# Altium project 电解水杯V1.1_ZM_20210702.PrjPCB
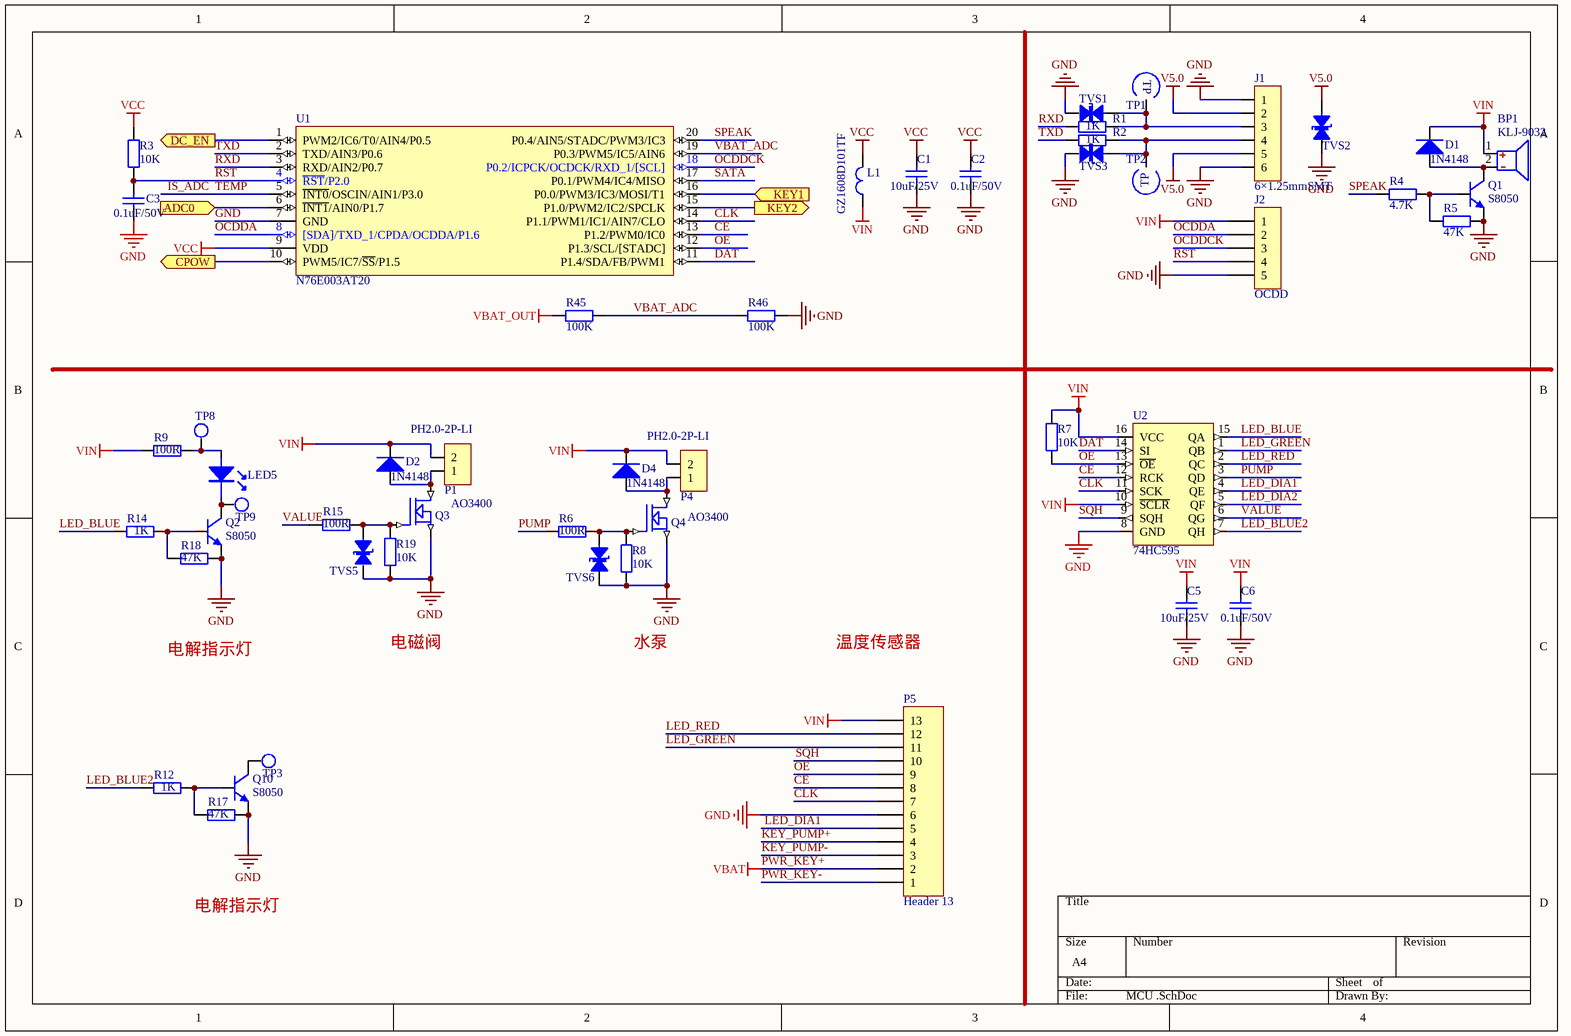
[diagram p0: MCU .SchDoc]
3 sheets, 137 parts. Net scope: global (net labels, ports and power ports of the same name join across sheets).
Board file: 水杯V1.1_ZM_20210702.PcbDoc
Sheets:
  MCU .SchDoc
  POWER.SchDoc
  Sheet2.SchDoc

## Sheet MCU .SchDoc
size A4

### Parts
BP1  KLJ-9032  [SP9025]
C1  10uF/25V  [SMD-0603C]
C2  0.1uF/50V  [SMD-0603C]
C3  0.1uF/50V  [SMD-0603C]
C5  10uF/25V  [SMD-0603C]
C6  0.1uF/50V  [SMD-0603C]
D1  1N4148  [SOD-123]
D2  1N4148  [SOD-123]
D4  1N4148  [SOD-123]
J1  6×1.25mmSMT  [6×1.25mmSMT]
J2  OCDD  [sip-5]
L1  GZ1608D101TF  [SMD-0603]
LED5  蓝光 3528  [led-3528]  (value not drawn)
P1  PH2.0-2P-LI  [PH2.0-2P-LI]
P4  PH2.0-2P-LI  [PH2.0-2P-LI]
P5  Header 13  [13×1.25mmSMT]
Q1  S8050  [SOT-23]
Q2  S8050  [SOT-23]
Q3  AO3400  [SOT-23]
Q4  AO3400  [SOT-23]
Q10  S8050  [SOT-23]
R1  1K  [SMD-0603]
R2  1K  [SMD-0603]
R3  10K  [SMD-0603]
R4  4.7K  [SMD-0603]
R5  47K  [SMD-0603]
R6  100R  [SMD-0603]
R7  10K  [SMD-0603]
R8  10K  [SMD-0603]
R9  100R  [SMD-0805]
R12  1K  [SMD-0603]
R14  1K  [SMD-0603]
R15  100R  [SMD-0603]
R17  47K  [SMD-0603]
R18  47K  [SMD-0603]
R19  10K  [SMD-0603]
R45  100K  [SMD-0603]
R46  100K  [SMD-0603]
TP1  testpoint  [TP]  (value not drawn)
TP2  testpoint  [TP]  (value not drawn)
TP3  TPS  [HOLE]  (value not drawn)
TP8  TPS  [HOLE]  (value not drawn)
TP9  TPS  [HOLE]  (value not drawn)
TVS1  ESD5Z5.0CT1G  [SOD-523]  (value not drawn)
TVS2  ESD5Z5.0CT1G  [SOD-123]  (value not drawn)
TVS3  ESD5Z5.0CT1G  [SOD-523]  (value not drawn)
TVS5  ESD5Z5.0CT1G  [SOD-523]  (value not drawn)
TVS6  ESD5Z5.0CT1G  [SOD-523]  (value not drawn)
U1  N76E003AT20  [TSSOP20]
U2  74HC595  [SSOP-16]

### Ports
ADC0 (in), CPOW (out), DC_EN (out), KEY1 (in), KEY2 (out)

### Nets
GND: C1.1 C2.1 C3.2 C5.1 C6.1 J1.1 J1.6 J2.5 P5.6 Q1.2(E) Q2.2(E) Q3.2(S) Q4.2(S) Q10.2(E) R5.2 R8.1 R17.2 R18.2 R19.1 R46.2 TVS1.1(A) TVS2.1(A) TVS3.1(A) TVS5.1(A) TVS6.1(A) U1.7(GND) U2.8(GND)
KEY_PUMP+: BP1.1(VCC) C5.2 C6.2 D1.2(K) D2.2(K) D4.2(K) J2.1 L1.1 P1.2 P4.2 P5.4 P5.13 R7.2 R9.2 U2.10(~{SCLR}) U2.16(VCC)  [also labelled VIN]
PWR_KEY+: P5.2  [also labelled VBAT]
SATA: J1.2 J1.5 TVS2.2(B) U1.17(P0.1/PWM4/IC4/MISO)  [also labelled V5.0]
VBAT_OUT: R45.1
VCC: C1.2 C2.2 L1.2 R3.1 U1.9(VDD)
CE: P5.8 U1.13(P1.2/PWM0/IC0) U2.12(RCK)
CLK: P5.7 U1.14(P1.1/PWM1/IC1/AIN7/CLO) U2.11(SCK)
DAT: U1.11(P1.4/SDA/FB/PWM1) U2.14(SI)
IS_ADC: U1.5(~{INT0}/OSCIN/AIN1/P3.0)  [also labelled TEMP]
KEY_PUMP-: P5.3
LED_BLUE: R14.1 U2.15(QA)
LED_BLUE2: R12.1 U2.7(QH)
LED_DIA1: P5.5 U2.4(QE)
LED_DIA2: U2.5(QF)
LED_GREEN: P5.11 U2.1(QB)
LED_RED: P5.12 U2.2(QC)
OCDDA: J2.2 U1.8([SDA]/TXD_1/CPDA/OCDDA/P1.6)
OCDDCK: J2.3 U1.18(P0.2/ICPCK/OCDCK/RXD_1/[SCL])
OE: P5.9 R7.1 U1.12(P1.3/SCL/[STADC]) U2.13(~{OE})
PUMP: R6.1 U2.3(QD)
PWR_KEY-: P5.1
RST: C3.1 J2.4 R3.2 U1.4(~{RST}/P2.0)
RXD: R1.2 U1.3(RXD/AIN2/P0.7)
SPEAK: R4.1 U1.20(P0.4/AIN5/STADC/PWM3/IC3)
SQH: P5.10 U2.9(SQH)
TXD: R2.2 U1.2(TXD/AIN3/P0.6)
VALUE: R15.1 U2.6(QG)
VBAT_ADC: R45.2 R46.1 U1.19(P0.3/PWM5/IC5/AIN6)
NetBP1_2: BP1.2 D1.1(A) Q1.3(C)
NetC18_2: U1.15(P1.0/PWM2/IC2/SPCLK) ; port KEY2
NetC26_1: U1.6(~{INT1}/AIN0/P1.7) ; port ADC0
NetD2_1: D2.1(A) P1.1 Q3.3(D)
NetD4_1: D4.1(A) P4.1 Q4.3(D)
NetJ1_3: J1.3 R1.1 TP1.1 TVS1.2(B)
NetJ1_4: J1.4 R2.1 TP2.1 TVS3.2(B)
NetLED5_1: LED5.1 R9.1 TP8.1
NetLED5_2: LED5.2 Q2.3(C) TP9.1
NetQ1_1: Q1.1(B) R4.2 R5.1
NetQ2_1: Q2.1(B) R14.2 R18.1
NetQ3_1: Q3.1(G) R15.2 R19.2 TVS5.2(B)
NetQ4_1: Q4.1(G) R6.2 R8.2 TVS6.2(B)
NetQ10_1: Q10.1(B) R12.2 R17.1
NetQ10_3: Q10.3(C) TP3.1
NetR16_1: U1.16(P0.0/PWM3/IC3/MOSI/T1) ; port KEY1
NetR26_1: U1.10(PWM5/IC7/~{SS}/P1.5) ; port CPOW
NetR33_1: U1.1(PWM2/IC6/T0/AIN4/P0.5) ; port DC_EN

### Notes on the sheet
- 电解指示灯
- 电磁阀
- 水泵
- 温度传感器
- (in symbol TP-1) TP

### Library data of the parts
BP1 = SPEAKER: 无源蜂鸣器 3.3V 频率2731
C1-C3 C5 C6 = CAP4: 贴片电容 10%
D1 D2 D4 = DIODE2: 小封装二极管
J1 = SIP-6: USB 3.1 Type-C 2.0短体母座 6P贴片式
J2 = SIP-5: 下载口(NC)
L1 = CIZHU1: 贴片磁珠100R 100M
LED5 = LED0: LED 3528 蓝
P1 P4 = SIP-2: 间距2.0mm 立贴 2Pin
P5 = Header 13: Header, 13-Pin; LatestRevisionDate: 17-Jul-2002; LatestRevisionNote: Re-released for DXP Platform.; Publisher: Altium Limited
Q1 Q2 Q10 = NPN-1: NPN
Q3 Q4 = MOSFET N
R1-R9 R12 R14 R15 R17-R19 R45 R46 = RES0: 贴片电阻 5%
TP1 TP2 = TP-1: 测试点
TVS1-TVS3 TVS5 TVS6 = TVS-1: ESD二极管
U1 = N76E003AT20: 新唐MCU
U2 = 74HC595: 逻辑IC

## Sheet POWER.SchDoc
size A3
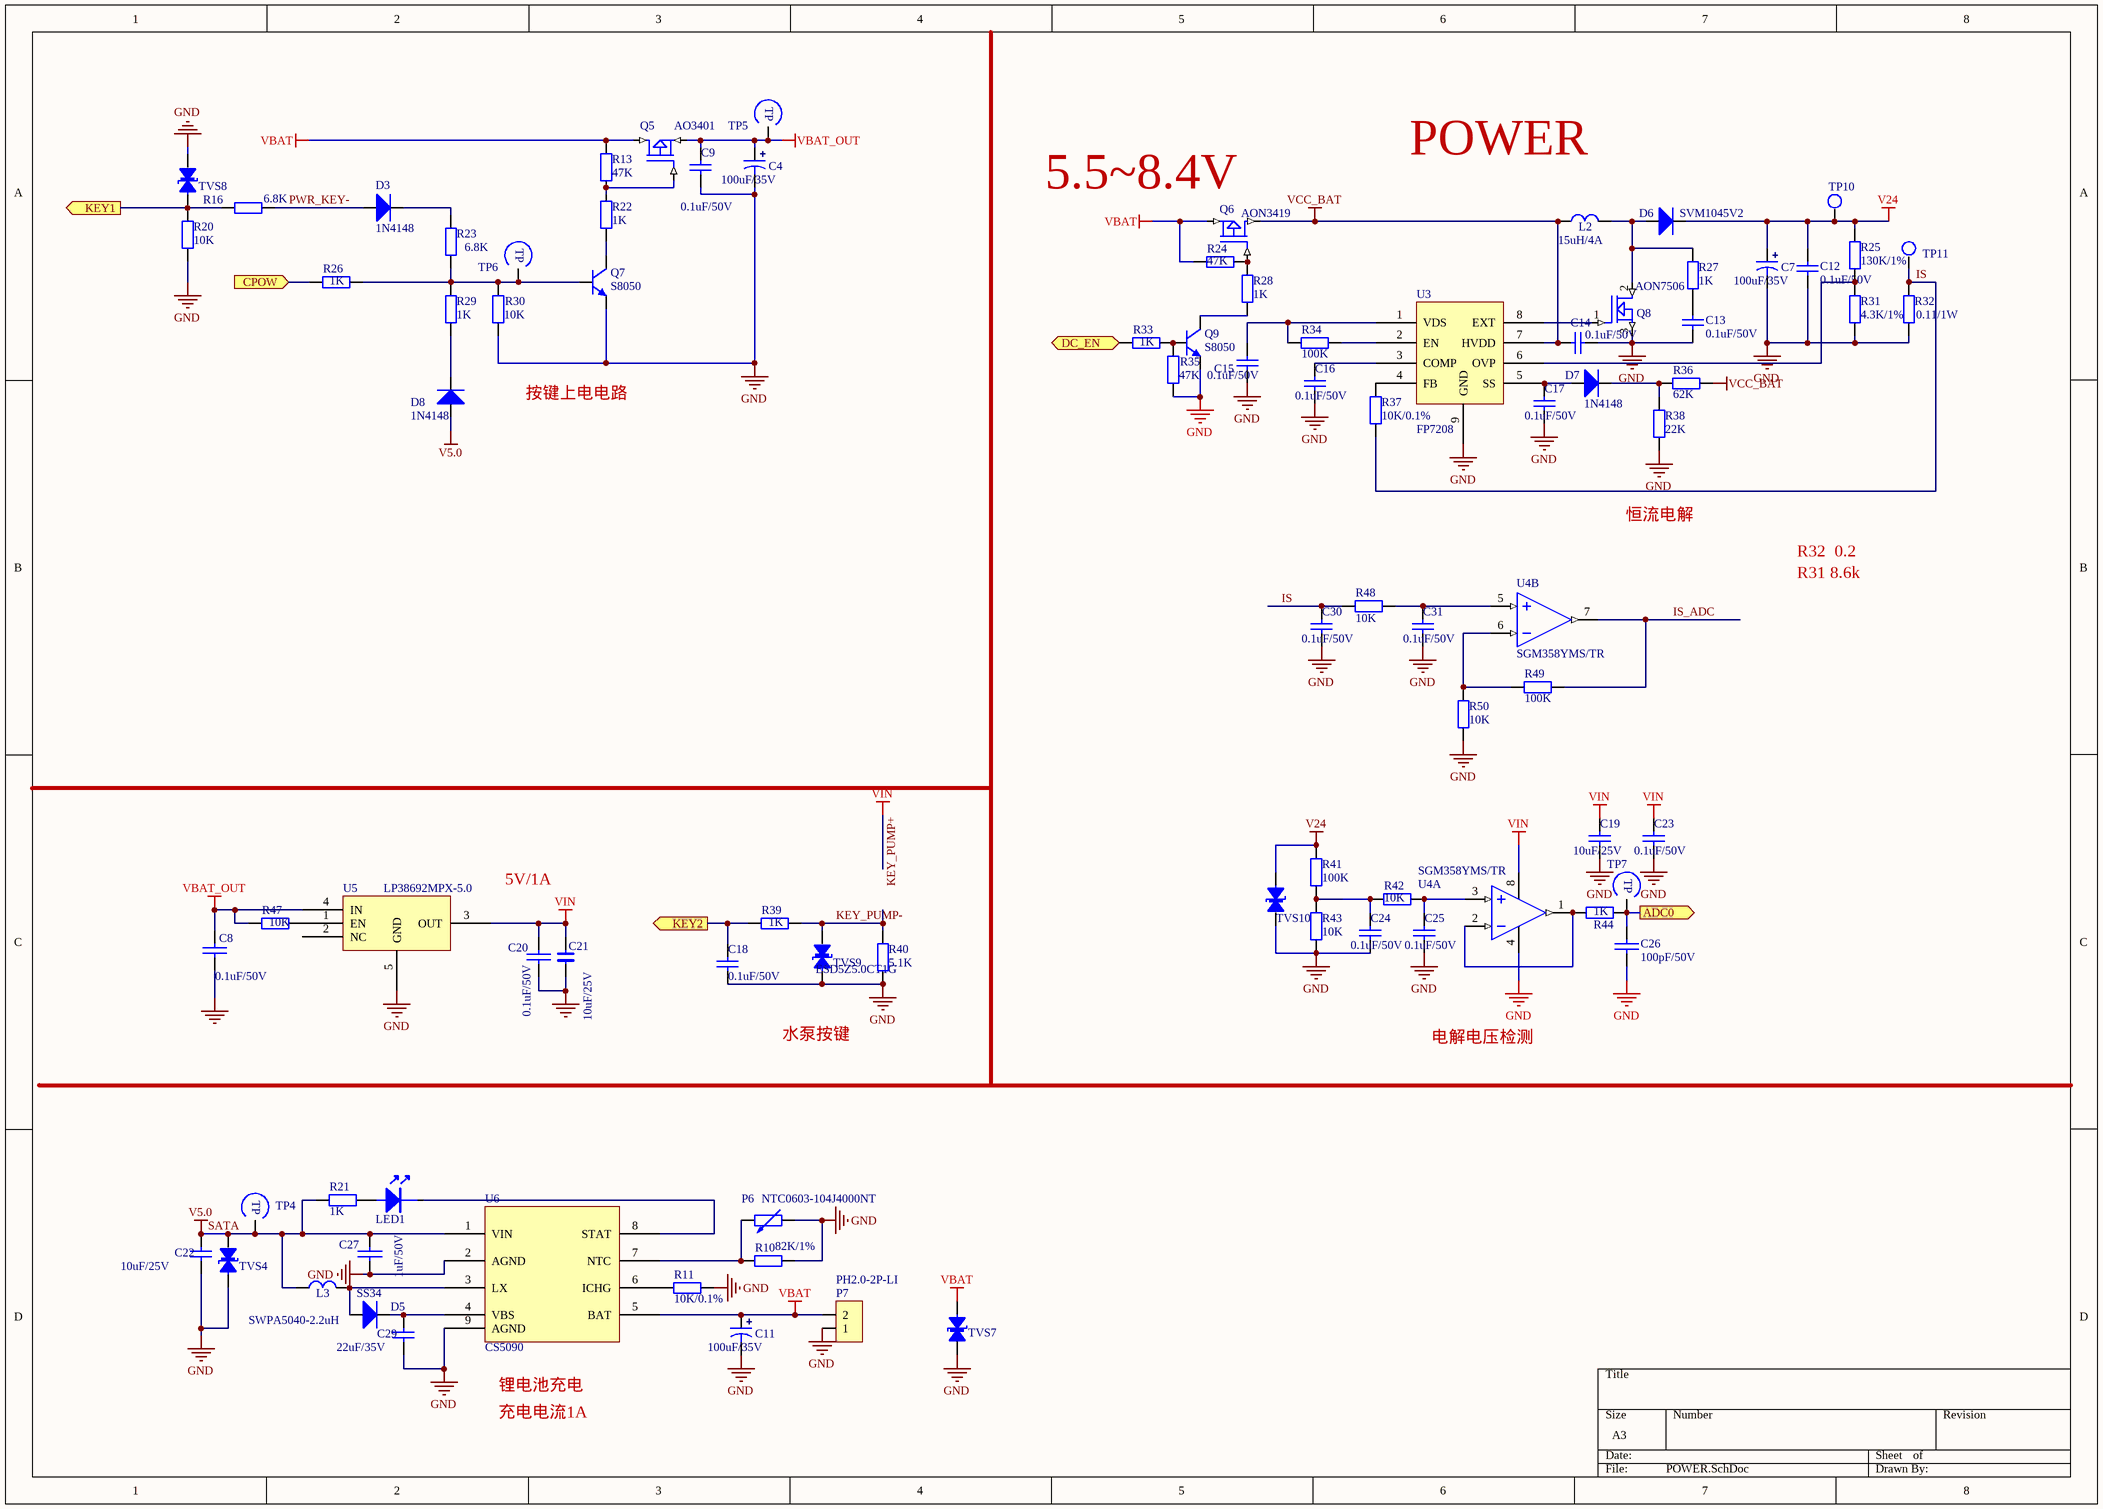
[diagram p1: POWER.SchDoc]

### Parts
C4  100uF/35V  [6*8]
C7  100uF/35V  [6*8]
C8  0.1uF/50V  [SMD-0603C]
C9  0.1uF/50V  [SMD-0603C]
C11  100uF/35V  [6*8]
C12  0.1uF/50V  [SMD-0603C]
C13  0.1uF/50V  [SMD-0603C]
C14  0.1uF/50V  [SMD-0603C]
C15  0.1uF/50V  [SMD-0603C]
C16  0.1uF/50V  [SMD-0603C]
C17  0.1uF/50V  [SMD-0603C]
C18  0.1uF/50V  [SMD-0603C]
C19  10uF/25V  [SMD-0603C]
C20  0.1uF/50V  [SMD-0603C]
C21  10uF/25V  [SMD-0603C]
C22  10uF/25V  [SMD-0603C]
C23  0.1uF/50V  [SMD-0603C]
C24  0.1uF/50V  [SMD-0603C]
C25  0.1uF/50V  [SMD-0603C]
C26  100pF/50V  [SMD-0603C]
C27  1uF/50V  [SMD-0603C]
C29  22uF/35V  [SMD-0603C]
C30  0.1uF/50V  [SMD-0603C]
C31  0.1uF/50V  [SMD-0603C]
D3  1N4148  [SOD-523]
D5  SS34  [DO-214-AC]
D6  SVM1045V2  [TO227]
D7  1N4148  [SOD-523]
D8  1N4148  [SOD-523]
L2  15uH/4A  [INDUCTOR7*7]
L3  SWPA5040-2.2uH  [INDUCTOR_5*5]
LED1  蓝光 3528  [SMD-0603D]  (value not drawn)
P6  NTC0603-104J4000NT  [SMD-0603]
P7  PH2.0-2P-LI  [PH2.0-2P-LI]
Q5  AO3401  [SOT-23]
Q6  AON3419  [DFN3*3-8]
Q7  S8050  [SOT-23]
Q8  AON7506  [DFN3*3-8]
Q9  S8050  [SOT-23]
R10  82K/1%  [SMD-0603]
R11  10K/0.1%  [SMD-0603]
R13  47K  [SMD-0603]
R16  6.8K  [SMD-0603]
R20  10K  [SMD-0603]
R21  1K  [SMD-0603]
R22  1K  [SMD-0603]
R23  6.8K  [SMD-0603]
R24  47K  [SMD-0603]
R25  130K/1%  [SMD-0603]
R26  1K  [SMD-0603]
R27  1K  [SMD-0603]
R28  1K  [SMD-0603]
R29  1K  [SMD-0603]
R30  10K  [SMD-0603]
R31  4.3K/1%  [SMD-0603]
R32  0.11/1W  [2512R]
R33  1K  [SMD-0603]
R34  100K  [SMD-0603]
R35  47K  [SMD-0603]
R36  62K  [SMD-0603]
R37  10K/0.1%  [SMD-0603]
R38  22K  [SMD-0603]
R39  1K  [SMD-0603]
R40  5.1K  [SMD-0603]
R41  100K  [SMD-0603]
R42  10K  [SMD-0603]
R43  10K  [SMD-0603]
R44  1K  [SMD-0603]
R47  10K  [SMD-0603]
R48  10K  [SMD-0603]
R49  100K  [SMD-0603]
R50  10K  [SMD-0603]
TP4  testpoint  [TP]  (value not drawn)
TP5  testpoint  [TP]  (value not drawn)
TP6  testpoint  [TP]  (value not drawn)
TP7  testpoint  [TP]  (value not drawn)
TP10  TPS  [HOLE]  (value not drawn)
TP11  TPS  [HOLE]  (value not drawn)
TVS4  ESD5Z5.0CT1G  [SOD-523]  (value not drawn)
TVS7  SMF12CA  [SOD-123]  (value not drawn)
TVS8  ESD5Z5.0CT1G  [SOD-523]  (value not drawn)
TVS9  ESD5Z5.0CT1G  [SOD-523]
TVS10  SMF24CA  [SOD-123]  (value not drawn)
U3  FP7208  [SOP127P600X265_HS-9N]
U4  SGM358YMS/TR  [MSOP-8]  (parts A,B of 2)
U5  LP38692MPX-5.0  [SOT223-5]
U6  CS5090  [SOP127P600X265_HS-9N]

### Ports
ADC0 (out), CPOW (in), DC_EN (in), KEY1 (out), KEY2 (out)

### Nets
GND: C4.2 C7.2 C8.2 C9.1 C11.2 C12.2 C13.2 C14.1 C15.1 C16.1 C17.1 C18.1 C19.1 C20.2 C21.1 C22.1 C23.1 C24.1 C25.1 C26.2 C27.2 C29.1 C30.1 C31.1 P6.1 P7.1 Q7.2(E) Q8.3(S) Q9.2(E) R10.1 R11.1 R20.1 R30.1 R31.2 R32.1 R35.1 R38.2 R40.1 R43.1 R50.2 TVS4.2(B) TVS7.1(A) TVS8.1(A) TVS9.2(B) TVS10.1(A) U3.9(GND) U4.4(V-) U5.5(GND) U6.2(AGND) U6.9(AGND)
KEY_PUMP+: C19.2 C20.1 C21.2 C23.2 U4.8(V+) U5.3(OUT)  [also labelled VIN]
SATA: C22.2 C27.1 D8.1(A) L3.1 R21.1 TP4.1 TVS4.1(A) U6.1(VIN)  [also labelled V5.0]
V24: C7.1 C12.1 D6.2(K) R25.1 R41.2 TP10.1 TVS10.2(B)
VBAT: C11.1 P7.2 Q5.2(D) Q6.3(S) R13.1 R24.1 TVS7.2(B) U6.5(BAT)  [project net PWR_KEY+]
VBAT_OUT: C4.1 C8.1 C9.2 Q5.3(S) R47.1 TP5.1 U5.4(IN)
VCC_BAT: C14.2 L2.1 Q6.2(D) R36.2 U3.7(HVDD)
IS: C30.2 R32.2 R37.1 R48.2 TP11.1
IS_ADC: R49.2 U4.7(OUT2)
KEY_PUMP-: R39.2 R40.2 TVS9.1(A)
PWR_KEY-: D3.1(A) R16.2
NetC13_1: C13.1 R27.2
NetC15_2: C15.2 R34.1 U3.1(VDS)
NetC16_2: C16.2 U3.3(COMP)
NetC17_2: C17.2 D7.1(A) U3.5(SS)
NetC18_2: C18.2 R39.1 ; port KEY2
NetC24_2: C24.2 R41.1 R42.2 R43.2
NetC25_2: C25.2 R42.1 U4.3(IN1+)
NetC26_1: C26.1 R44.1 TP7.1 ; port ADC0
NetC29_2: C29.2 D5.2(K) U6.4(VBS)
NetC31_2: C31.2 R48.1 U4.5(IN2+)
NetD3_2: D3.2(K) R23.2
NetD5_1: D5.1(A) L3.2 U6.3(LX)
NetD6_1: D6.1(A) L2.2 Q8.2(D) R27.1
NetD7_2: D7.2(K) R36.1 R38.1
NetD8_2: D8.2(K) R29.1
NetLED1_1: LED1.1 R21.2
NetLED1_2: LED1.2 U6.8(STAT)
NetP6_2: P6.2 R10.2 U6.7(NTC)
NetQ5_1: Q5.1(G) R13.2 R22.2
NetQ6_1: Q6.1(G) R24.2 R28.1
NetQ7_1: Q7.1(B) R23.1 R26.2 R29.2 R30.2 TP6.1
NetQ7_3: Q7.3(C) R22.1
NetQ8_1: Q8.1(G) U3.8(EXT)
NetQ9_1: Q9.1(B) R33.2 R35.2
NetQ9_3: Q9.3(C) R28.2
NetR11_2: R11.2 U6.6(ICHG)
NetR16_1: R16.1 R20.2 TVS8.2(B) ; port KEY1
NetR25_2: R25.2 R31.1 U3.6(OVP)
NetR26_1: R26.1 ; port CPOW
NetR33_1: R33.1 ; port DC_EN
NetR34_2: R34.2 U3.2(EN)
NetR37_2: R37.2 U3.4(FB)
NetR44_2: R44.2 U4.1(OUT1) U4.2(IN1-)
NetR47_2: R47.2 U5.1(EN)
NetR49_1: R49.1 R50.1 U4.6(IN2-)

Not connected (* = marked no-connect by the designer): U5 2(NC)

### Notes on the sheet
- POWER
- (near Q6) 5.5~8.4V
- 按键上电电路
- 恒流电解
- R32  0.2
- R31 8.6k
- 5V/1A
- 水泵按键
- 电解电压检测
- (near U6) 锂电池充电
- 充电电流1A
- (in symbol TP-1) TP

### Library data of the parts
C4 C7 C11 = CAP2: 电解电容
C8 C20 C27 = CAP: Capacitor
C9 C12-C19 C23-C25 C29-C31 = CAP4: 贴片电容 10%
C21 = C
C22 = CAP4: 贴片电容 20%
C26 = C: 贴片电容 10%
D3 D7 D8 = DIODE2: 小封装二极管
D5 D6 = DIODE2: 肖特基二极管
L2 L3 = Inductor1: 10uH 1A
LED1 = LED0: LED 3528 蓝
P6 = RES3: 卧贴
P7 = SIP-2: 间距2.0mm 立贴 2Pin
Q5 = MOSFET P
Q6 = MOSFET-P-B: MOSFET-P
Q7 Q9 = NPN-1: NPN
Q8 = MOSFET N
R10 R11 R44 = R: 贴片电阻 1%
R13 R16 R20-R40 R47 = R: 贴片电阻 5%
R41 R43 = RES0: 贴片电阻 1%
R42 R48-R50 = RES0: 贴片电阻 5%
TP4-TP7 = TP-1: 测试点
TVS4 TVS7-TVS10 = TVS-1: ESD二极管
U4 = LM358: 运放
U6 = CS5095E

## Sheet Sheet2.SchDoc
size A2

## Nets that join several sheets
GND: MCU  (27 pins), POWER (50 pins)
KEY_PUMP+: MCU  (16 pins), POWER (6 pins)
PWR_KEY+: MCU  (P5.2), POWER (8 pins)
SATA: MCU  (J1.2 J1.5 TVS2.2 U1.17), POWER (8 pins)
VBAT_OUT: MCU  (R45.1), POWER (7 pins)
IS_ADC: MCU  (U1.5), POWER (R49.2 U4.7)
KEY_PUMP-: MCU  (P5.3), POWER (R39.2 R40.2 TVS9.1)
NetC18_2: MCU  (U1.15), POWER (C18.2 R39.1)
NetC26_1: MCU  (U1.6), POWER (C26.1 R44.1 TP7.1)
NetR16_1: MCU  (U1.16), POWER (R16.1 R20.2 TVS8.2)
NetR26_1: MCU  (U1.10), POWER (R26.1)
NetR33_1: MCU  (U1.1), POWER (R33.1)
PWR_KEY-: MCU  (P5.1), POWER (D3.1 R16.2)